# Altium schematic sheet ERROR_DISPLAY.SchDoc: Error display
size A4; Author: eldar6776@hotmail.com; DrawnBy: Eldar Dedić; Organization: PROVEN d.o.o.; Address1: Adema Buće 102; Address2: 71000 Sarajevo; Address3: Federacija BiH; Address4: Bosna i Hercegovina; DocumentNumber: CD-26514; Revision: 001; SheetNumber: 8; SheetTotal: 8; ProjectName: KONTROLER TRANSPORTA MATERIJALA
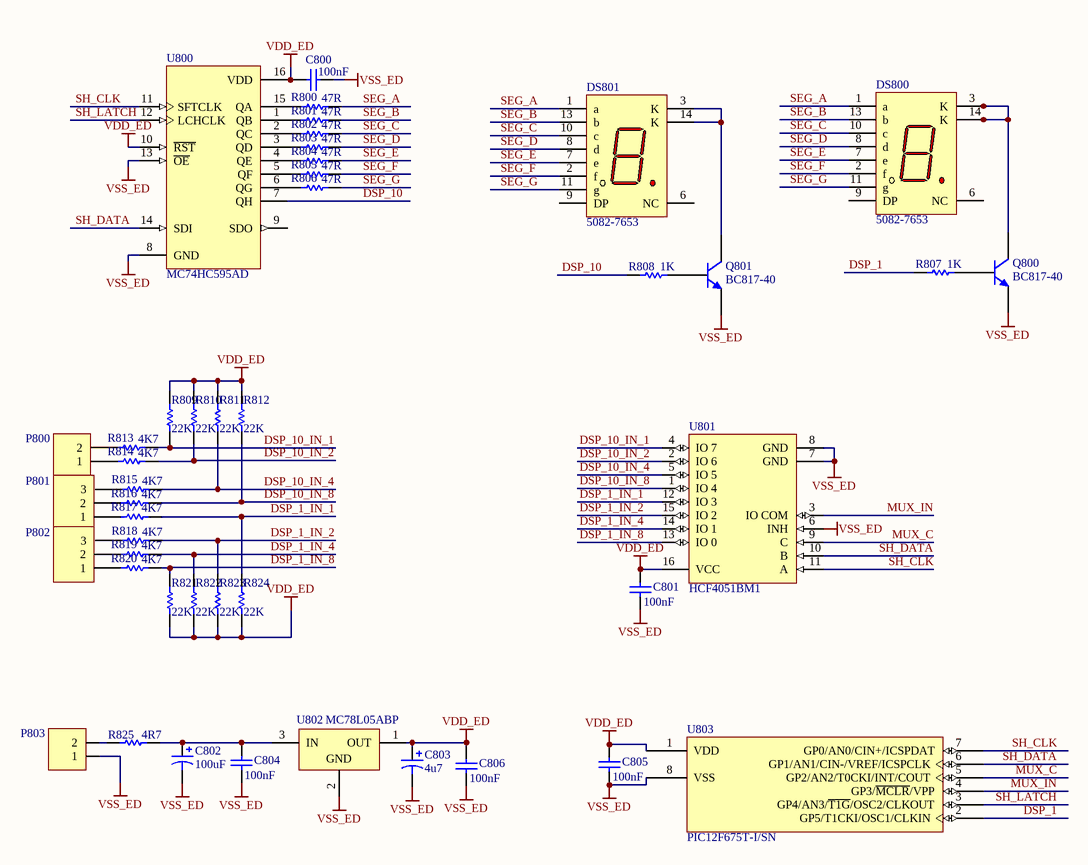
[diagram p0: ERROR_DISPLAY.SchDoc]

## Parts
C800  value 100nF  [0805]
C801  value 100nF  [0805]
C802  100uF  [C]
C803  4u7  [B]
C804  value 100nF  [0805]
C805  value 100nF  [0805]
C806  value 100nF  [0805]
DS800  5082-7653  [E-11(R)]
DS801  5082-7653  [E-11(R)]
P800  (no value)  [TERMINAL BLOK 2]
P801  (no value)  [TERMINAL BLOK]
P802  (no value)  [TERMINAL BLOK]
P803  (no value)  [TERMINAL BLOK 2]
Q800  BC817-40  [SOT23_N]
Q801  BC817-40  [SOT23_N]
R800  47R  [ERA-0603]
R801  47R  [ERA-0603]
R802  47R  [ERA-0603]
R803  47R  [ERA-0603]
R804  47R  [ERA-0603]
R805  47R  [ERA-0603]
R806  47R  [ERA-0603]
R807  1K  [ERA-0603]
R808  1K  [ERA-0603]
R809  22K  [ERA-0603]
R810  22K  [ERA-0603]
R811  22K  [ERA-0603]
R812  22K  [ERA-0603]
R813  4K7  [ERA-0603]
R814  4K7  [ERA-0603]
R815  4K7  [ERA-0603]
R816  4K7  [ERA-0603]
R817  4K7  [ERA-0603]
R818  4K7  [ERA-0603]
R819  4K7  [ERA-0603]
R820  4K7  [ERA-0603]
R821  22K  [ERA-0603]
R822  22K  [ERA-0603]
R823  22K  [ERA-0603]
R824  22K  [ERA-0603]
R825  4R7  [RD3.2x1.7]
U800  MC74HC595AD  [751B-05_N]
U801  HCF4051BM1  [SO16_N]
U802  MC78L05ABP  [29-04]
U803  PIC12F675T-I/SN  [SOIC-SN8_N]

## Nets
VDD_ED: C800.2 C801.1 C803.1 C805.1 C806.1 R809.2 R810.2 R811.2 R812.2 R821.1 R822.1 R823.1 R824.1 U800.10(~{RST}) U800.16(VDD) U801.16(VCC) U802.1(OUT) U803.1(VDD)
VSS_ED: C800.1 C801.2 C802.2 C803.2 C804.2 C805.2 C806.2 P803.1 Q800.2(E) Q801.2(E) U800.8(GND) U800.13(~{OE}) U801.6(INH) U801.7(GND) U801.8(GND) U802.2(GND) U803.8(VSS)
DSP_1: R807.1 U803.2(GP5/T1CKI/OSC1/CLKIN)
DSP_1_IN_1: R817.2 R824.2 U801.12(IO_3)
DSP_1_IN_2: R818.2 R823.2 U801.15(IO_2)
DSP_1_IN_4: R819.2 R822.2 U801.14(IO_1)
DSP_1_IN_8: R820.2 R821.2 U801.13(IO_0)
DSP_10: R808.1 U800.7(QH)
DSP_10_IN_1: R809.1 R813.2 U801.4(IO_7)
DSP_10_IN_2: R810.1 R814.2 U801.2(IO_6)
DSP_10_IN_4: R811.1 R815.2 U801.5(IO_5)
DSP_10_IN_8: R812.1 R816.2 U801.1(IO_4)
MUX_C: U801.9(C) U803.5(GP2/AN2/T0CKI/INT/COUT)
MUX_IN: U801.3(IO_COM) U803.4(GP3/~{MCLR}/VPP)
SEG_A: DS800.1(a) DS801.1(a) R800.2
SEG_B: DS800.13(b) DS801.13(b) R801.2
SEG_C: DS800.10(c) DS801.10(c) R802.2
SEG_D: DS800.8(d) DS801.8(d) R803.2
SEG_E: DS800.7(e) DS801.7(e) R804.2
SEG_F: DS800.2(f) DS801.2(f) R805.2
SEG_G: DS800.11(g) DS801.11(g) R806.2
SH_CLK: U800.11(SFTCLK) U801.11(A) U803.7(GP0/AN0/CIN+/ICSPDAT)
SH_DATA: U800.14(SDI) U801.10(B) U803.6(GP1/AN1/CIN-/VREF/ICSPCLK)
SH_LATCH: U800.12(LCHCLK) U803.3(GP4/AN3/~{T1G}/OSC2/CLKOUT)
NetC802_1: C802.1 C804.1 R825.2 U802.3(IN)
NetDS800_3: DS800.3(K) DS800.14(K) Q800.3(C)
NetDS801_3: DS801.3(K) DS801.14(K) Q801.3(C)
NetP800_1: P800.1 R814.1
NetP800_2: P800.2 R813.1
NetP801_1: P801.1 R817.1
NetP801_2: P801.2 R816.1
NetP801_3: P801.3 R815.1
NetP802_1: P802.1 R820.1
NetP802_2: P802.2 R819.1
NetP802_3: P802.3 R818.1
NetP803_2: P803.2 R825.1
NetQ800_1: Q800.1(B) R807.2
NetQ801_1: Q801.1(B) R808.2
NetR800_1: R800.1 U800.15(QA)
NetR801_1: R801.1 U800.1(QB)
NetR802_1: R802.1 U800.2(QC)
NetR803_1: R803.1 U800.3(QD)
NetR804_1: R804.1 U800.4(QE)
NetR805_1: R805.1 U800.5(QF)
NetR806_1: R806.1 U800.6(QG)

Not connected (* = marked no-connect by the designer): DS800 6(NC) 9(DP); DS801 6(NC) 9(DP); U800 9(SDO)

## Notes on the sheet
- Title
- Size:
- Date:
- A4
- Number:
- Time:
- Revision:
- Sheet
- of
- File:

## Library data of the parts
C800 C801 C804-C806 = C0805: Ceramic Chip Capacitor - Standard; Note: Footprint corresponds to dimensions for bulk cassette packaging. This case size has tightened tolerances.; Published: 17-Jul-2002; LatestRevisionDate: 19-Mar-2004; LatestRevisionNote: Silkscreen size reduced.; DatasheetDocument: Mar-2001; PackageDocument: Mar-2001; PackageReference: 0805; Publisher: Altium Limited; Code_JEITA: 0805; Code_IPC: 2012[0805]; ComponentLink1Description: Manufacturer Link; ComponentLink1URL: http://www.kemet.com/; ComponentLink2Description: Datasheet; ComponentLink2URL: http://www.kemet.com/kemet/web/homepage/kechome.nsf/vapubfilesname/F3102TA.pdf/$file/F3102TA.pdf
C802 = 94SC106X0025CBP: Solid Aluminum Capacitor with Organic Semiconductor Electrolyte: 10uF, 25V, Bulk Pack; Note: Part Numbers shown are for ± 20% capacitance tolerance (X0).; PCB_Layout: Complies with Manufacturer's Recommendation.; DrillSize: Nominal, Rounded to the nearest 0.1mm; Published: 19-Mar-2004; DatasheetDocument: 23-May-2001; PackageReference: C; Publisher: Altium Limited; ComponentLink1Description: Manufacturer Link; ComponentLink1URL: http://www.vishay.com/; ComponentLink2Description: Datasheet; ComponentLink2URL: http://www.vishay.com/docs/90004/94sc.pdf; Value: 10uF
C803 = 94SC225X0030BBP: Solid Aluminum Capacitor with Organic Semiconductor Electrolyte: 2.2uF, 30V, Bulk Pack; Note: Part Numbers shown are for ± 20% capacitance tolerance (X0).; PCB_Layout: Complies with Manufacturer's Recommendation.; DrillSize: Nominal, Rounded to the nearest 0.1mm; Published: 19-Mar-2004; DatasheetDocument: 23-May-2001; PackageReference: B; Publisher: Altium Limited; ComponentLink1Description: Manufacturer Link; ComponentLink1URL: http://www.vishay.com/; ComponentLink2Description: Datasheet; ComponentLink2URL: http://www.vishay.com/docs/90004/94sc.pdf; Value: 2.2uF
DS800 DS801 = 5082-7653: 10.92 mm HER 7-Segment Display: CC, RH DP; LuminousIntensity: 340 ucd (Minimum).; LED_Colour: High Efficiency Red (HER); Note: Pins 3 and 14 are redundant Cathodes.; Note: No pins are present in positions 4, 5 and 12.; Published: 26-May-2004; LatestRevisionDate: 11-Oct-2004; LatestRevisionNote: Display outline superimposed on PCB Footprint.; DatasheetDocument: 27-Aug-2001; PackageDocument: 11-Mar-2003; PackageReference: E-11(R); Publisher: Altium Limited; ComponentLink1Description: Manufacturer Link; ComponentLink1URL: http://www.agilent.com/; ComponentLink2Description: Datasheet; ComponentLink2URL: http://cp.literature.agilent.com/litweb/pdf/5988-3325EN.pdf
P800 P803 = Terminal blok 2 pina: Terminal blok 2
P801 P802 = Terminal blok 3 pina: Terminal blok
Q800 Q801 = BC817-40: NPN General-purpose Transistor; Published: 17-Sep-2003; LatestRevisionDate: 12-Dec-2006; LatestRevisionNote: IPC-7351 Footprint Added.; DatasheetVersion: Jun-1999; PackageVersion: May-1999; PackageReference: SOT23; Publisher: Altium Limited; PackageDescription: 3-Pin SOT-23 Package 0.95 mm Pitch, 2.3 mm Lead Span; ComponentLink1Description: Manufacturer Link; ComponentLink1URL: http://www.semiconductors.philips.com/; ComponentLink2Description: Datasheet; ComponentLink2URL: http://www.semiconductors.philips.com/acrobat/datasheets/BC817_BC817W_BC337_5.pdf
R800-R824 = ERA3Y: Rectangular Thick Film Chip Resistor, 10 Ohm to 330k Ohm Range, 0.1% and 0.5% Tolerance, 0603 Size, 0.063 W; Note: If flow soldering, adjust pad width of PCB Footprint to 0.7 - 0.8 times the width of the resistor.; Published: 17-Dec-2003; LatestRevisionDate: 19-Mar-2004; LatestRevisionNote: Silkscreen size reduced.; PackageDocument: Mar-2003; PackageReference: ERA-0603; Publisher: Altium Limited; Code_IPC: 1608 [0603]; ComponentLink1Description: Manufacturer Link; ComponentLink1URL: http://www.panasonic.com/industrial/components/resistive_products.htm; ComponentLink2Description: Datasheet; ComponentLink2URL: http://www.panasonic.com/industrial/components/pdf/AOA0000CE8.pdf
R825 = ERD6FC: Flame-Retardant Fuse Type Carbon Film Resistor, 4.7 Ohm to 1k Ohm Range, 2% and 5% Tolerance, 0.166 W; Published: 17-Dec-2003; PackageReference: RD3.2x1.7; Publisher: Altium Limited; ComponentLink1Description: Manufacturer Link; ComponentLink1URL: http://www.panasonic.com/industrial/components/resistive_products.htm; ComponentLink2Description: Datasheet; ComponentLink2URL: http://www.panasonic.com/industrial/components/pdf/AOB0000CE5.pdf
U800 = MC74HC595AD: 8-Bit Serial-Input/Serial or Prallel-Output Shift Register with Latched 3-State Outputs; Published: 15-Apr-2002; LatestRevisionDate: 13-Apr-2006; LatestRevisionNote: IPC-7351 Footprint Added.; DatasheetVersion: Mar-2000; PackageVersion: Oct-1999; PackageReference: 751B-05; Publisher: Altium Limited; PackageDescription: 16-Pin Small Outline Integrated Circuit 1.27 mm Pitch; Code_JEDEC: MS-012-AC; Code_IPC: SOIC127P600-16; ComponentLink1Description: Manufacturer Link; ComponentLink1URL: http://www.onsemi.com/; ComponentLink2Description: Datasheet; ComponentLink2URL: http://www.onsemi.com/pub/Collateral/MC74HC595A-D.PDF
U801 = HCF4051BM1: Analog Multiplexer/Demultiplexer; Published: 8-Jun-2000; LatestRevisionDate: 13-Apr-2006; LatestRevisionNote: IPC-7351 Footprint Added.; DatasheetVersion: Jun-1989; PackageVersion: May-1998; PackageReference: SO16; Publisher: Altium Limited; PackageDescription: 16-Pin Small Outline Integrated Circuit 1.27 mm Pitch; Code_IPC: SOIC127P600-16; ComponentLink1Description: Manufacturer Link; ComponentLink1URL: http://www.st.com/; ComponentLink2Description: Datasheet; ComponentLink2URL: http://www.st.com/stonline/products/literature/ds/2053/hcf4051.pdf
U802 = MC78L05ABP: Three-Terminal Low Current Positive Voltage Regulator; Published: 15-Apr-2002; DatasheetVersion: Oct-1999; PackageVersion: 1996; PackageReference: 29-04; Publisher: Altium Limited; PackageDescription: TO, Flat Index; 3 In-Line, Axial Leads; Body Dia. 4.8mm; Leads 0.48 x 0.51 mm (max); ComponentLink1Description: Manufacturer Link; ComponentLink1URL: http://www.onsemi.com/site/products/taxonomy/0,4438,503,00.html; ComponentLink2Description: Datasheet; ComponentLink2URL: http://www.onsemi.com/pub/Collateral/MC78L00A-D.PDF
U803 = PIC12F675T-I/SN: FLASH-Based 8-Bit CMOS Microcontroller, 10-Bit A/D, 8-Pin SOIC 150mil, Industrial Temperature, Tape and Reel; Note: Refer to data sheet (DS41190F) for details of supply voltage range under different conditions.; Published: 11-Oct-2004; LatestRevisionDate: 02-Dec-2009; LatestRevisionNote: Updated to datasheet revision revF, Sep-2009.; DatasheetVersion: revF, Sep-2009; PackageVersion: revBB, Aug-2009; PackageReference: SOIC-SN8; Publisher: Altium Limited; PackageDescription: 8-Lead Plastic Small Outline (SN) - Narrow, 3.90mm Body [SOIC]; Supplier 1: Digi-Key; Supplier Part Number 1: PIC12F675T-I/SNTR-ND; Supplier 2: Farnell; Supplier Part Number 2: 1816055; Code_JEDEC: MS-012; Code_IPC: SOIC127P600-8; ComponentLink1Description: Datasheet; ComponentLink1URL: http://ww1.microchip.com/downloads/en/DeviceDoc/41190F.pdf; ComponentLink2Description: Packaging Specification; ComponentLink2URL: http://www.microchip.com/stellent/groups/techpub_sg/documents/packagingspec/en012702.pdf; ComponentLink3Description: Microchip.com Home; ComponentLink3URL: http://www.microchip.com/